# EAGLE design auto flash (EAGLE 7.3.0)
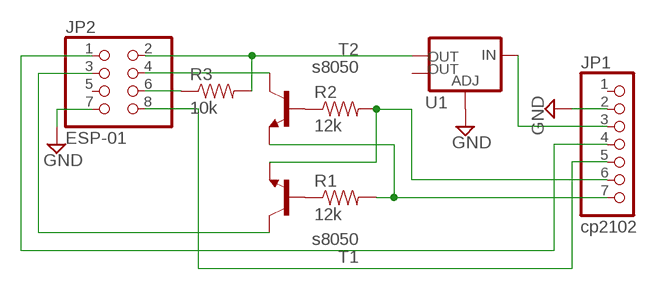
[diagram p0: schematic, sheet 1]

## Parts
JP1  cp2102  PINHD-1X7/90  [1X07/90]
JP2  ESP-01  PINHD-2X4  [2X04]
R1  12k  0.3OHM-1/8W-1%(0805)  [0805]
R2  12k  0.3OHM-1/8W-1%(0805)  [0805]
R3  10k  0.3OHM-1/8W-1%(0805)  [0805]
T1  s8050  2N2222  [TO92-EBC-OVAL]
T2  s8050  2N2222  [TO92-EBC-OVAL]
U1  V_REG_LM1117SOT223  [SOT223]

## Nets
ESP-01: JP1.4 JP2.1
GND: JP1.2 JP2.7 U1.1(ADJ)
N$1: JP1.7 R1.2 T2.E
N$2: R1.1 T1.B
N$3: R2.1 T2.B
N$4: JP2.4 T2.C
N$5: JP1.6 R2.2 T1.E
N$6: JP2.3 T1.C
N$7: JP1.5 JP2.8
N$8: JP2.2 R3.2 U1.2(OUT)
N$9: JP1.3 U1.3(IN)
N$11: JP2.6 R3.1
Unconnected: JP1.1 JP2.5 U1.4(OUT)

## Library data of the parts
JP1 = pinhead:PINHD-1X7: PIN HEADER
JP2 = pinhead:PINHD-2X4: PIN HEADER
R1-R3 = SparkFun-Resistors:0.3OHM-1/8W-1%(0805): RES-11622; PROD_ID: RES-11622; VALUE: 0.3
T1 T2 = adafruit:2N2222: NPN TRANSISTOR Big oval pads; OC_NEWARK: unknown
U1 = SparkFun-PowerIC:V_REG_LM1117: Voltage Regulator LM1117 Standard adjustable voltage regulator but in SMD form. Spark Fun Electronics SKU : COM-00595; PROD_ID: VREG-08170

## Board
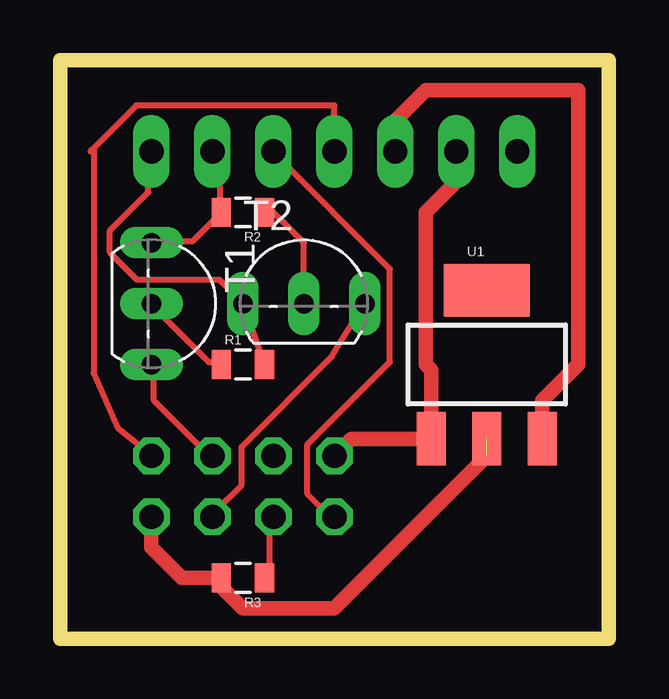
[diagram p1: board, top side]
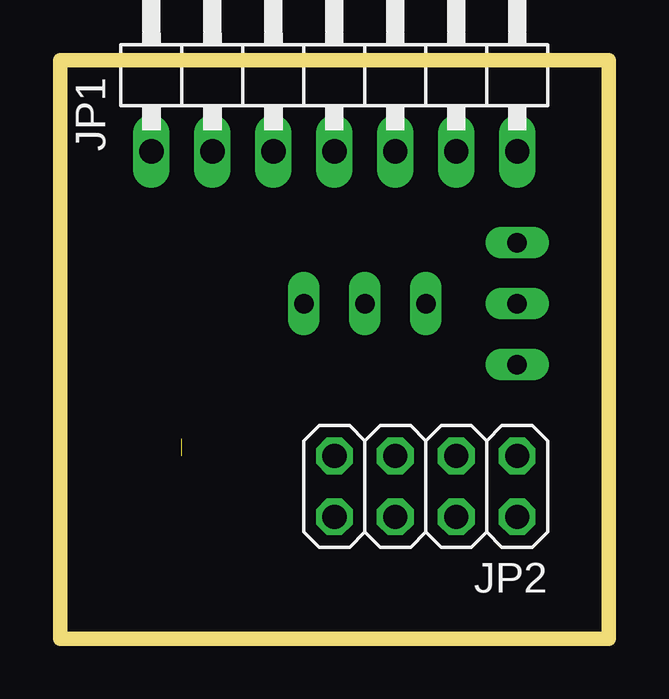
[diagram p2: board, bottom side, seen from below]

Size 22.86 x 24.13 mm. Coordinates in mm from the lower left corner, seen from the top.
Outline: 0,22.86 0,21.59 0,0 22.86,0 22.86,24.13 0,24.13 0,22.86
Copper layers (1*16): Top 0.035mm / dielectric 1.5mm / Bottom 0.035mm
Design rules "default": minimum track width 10mil, minimum drill 24mil, track to track 8mil, track to pad 8mil, pad to pad 8mil, via to via 8mil, smd to smd 8mil, copper to edge 40mil, drill to drill 8mil, minimum pad ring 10mil, minimum via ring 8mil, stop-mask expansion 4mil, vias tented up to drill 0mil, thermal gap 10mil

### Footprints (pad centres in the part's own frame; a part is rotated, then mirrored left to right if it is on the bottom)
1X07/90 = drill 1.016 long: 1 -7.62,-3.81; 2 -5.08,-3.81; 3 -2.54,-3.81; 4 0,-3.81; 5 2.54,-3.81; 6 5.08,-3.81; 7 7.62,-3.81
2X04 = drill 1.016 octagon: 1 -3.81,-1.27; 2 -3.81,1.27; 3 -1.27,-1.27; 4 -1.27,1.27; 5 1.27,-1.27; 6 1.27,1.27; 7 3.81,-1.27; 8 3.81,1.27
0805 = smd 0.8 x 1.2: 1 -0.9,0; 2 0.9,0
TO92-EBC-OVAL = drill 0.813 long: B 0,-1.27; C 2.54,-1.27; E -2.54,-1.27
SOT223 = smd 1.219 x 2.235: 1 -2.311,-3.099; 2 0,-3.099; 3 2.311,-3.099 | smd 3.6 x 2.2: 4 0,3.099

### Placement (x,y rotation side)
JP1  11.43,24.13 0 bottom
JP2  7.62,6.35 180 bottom
R1  7.62,11.43 0 top
R2  7.62,17.78 180 top
R3  7.62,2.54 180 top
T1  5.08,13.97 270 top
T2  10.16,15.24 0 top
U1  17.78,11.43 0 top

### Tracks (layer width: path | path; a pad name or v marks a point on that pad's centre or on a via)
ESP-01
  Top 0.254: 1.4,20.45 3.17,22.23 11.43,22.23 JP1.4 | 1.4,20.45 1.27,20.32 | 1.4,20.45 1.4,11.07 2.41,8.79 3.68,7.77 JP2.1
GND
  Top 0.61: JP2.7 12.14,8.33 U1.1 15.47,11.2 15.24,11.43 15.24,17.78 16.51,19.05 JP1.2
N$1
  Top 0.254: R1.2 T2.E 7.57,14.05 6.66,14.96 3.23,14.96 2.08,16.1 2.08,17.02 3.68,18.62 3.68,20.22 JP1.7
N$2
  Top 0.254: R1.1 6.66,11.53 6.2,11.53 3.91,13.82 T1.B
N$3
  Top 0.254: T2.B 10.16,16.51 8.89,17.78 R2.1
N$4
  Top 0.254: T2.C 12.6,13.82 11.33,11.76 7.57,8 7.57,6.4 6.43,5.26 JP2.4
N$5
  Top 0.254: JP1.6 6.43,20.22 6.66,19.99 6.66,17.93 R2.2 6.66,17.7 5.51,16.56 3.91,16.56 T1.E
N$6
  Top 0.254: T1.C 3.91,11.3 3.91,9.93 6.2,7.64 JP2.3
N$7
  Top 0.254: JP1.5 8.94,20.22 13.74,15.42 13.74,11.53 10.31,8.1 10.31,6.04 11.23,5.13 JP2.8
N$8  (1 unrouted)
  Top 0.61: JP2.2 3.81,3.81 5.08,2.54 R3.2 6.72,2.17 7.62,1.27 11.43,1.27 17.78,7.62
N$9
  Top 0.61: U1.3 20.09,9.93 21.59,11.43 21.59,22.86 15.24,22.86 13.97,21.59 JP1.3
N$11
  Top 0.254: R3.1 8.71,2.62 8.71,4.9 JP2.6